# EAGLE design SMD R1.4 (EAGLE 7.5.0)
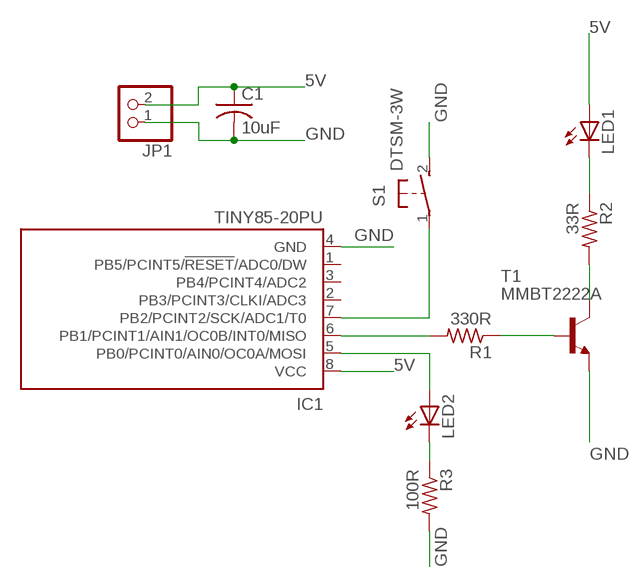
[diagram p0: schematic, sheet 1]

## Parts
C1  10uF  C-USC1206K  [C1206K]
IC1  TINY85-20PU  TINY13-20SU  [8S2]
JP1  PINHD-1X2  [1X02]
LED1  LED5MM  [LED5MM]
LED2  LEDSML1206  [SML1206]
R1  330R  R-US_R1206W  [R1206W]
R2  33R  R-US_R1206W  [R1206W]
R3  100R  R-US_R1206W  [R1206W]
S1  DTSM-3W  [DTSM-3W]
T1  MMBT2222A  MMBT2222ALT1-NPN-SOT23-BEC  [SOT23-BEC]

## Nets
5V: C1.1 IC1.8(VCC) JP1.2 LED1.A
GND: C1.2 IC1.4(GND) JP1.1 R3.2 S1.2 T1.E
N$1: IC1.5(PB0/PCINT0/AIN0/OC0A/MOSI) LED2.A
N$2: LED1.K(C) R2.1
N$3: R2.2 T1.C
N$4: R1.1 T1.B
N$5: IC1.6(PB1/PCINT1/AIN1/OC0B/INT0/MISO) R1.2
N$6: LED2.C R3.1
N$7: IC1.7(PB2/PCINT2/SCK/ADC1/T0) S1.1
Unconnected: IC1.1(PB5/PCINT5/!RESET!/ADC0/DW) IC1.2(PB3/PCINT3/CLKI/ADC3) IC1.3(PB4/PCINT4/ADC2)

## Library data of the parts
C1 = rcl:C-US: CAPACITOR, American symbol
IC1 = atmel:TINY13: 8-bit AVR Microcontroller with 1K Bytes In-System Programmable Flash Source: http://www.atmel.com/dyn/resources/prod_documents/2535S.pdf; MPN: ATTINY13-20SU; OC_FARNELL: 9171568; OC_NEWARK: 96K6522
JP1 = pinhead:PINHD-1X2: PIN HEADER
LED1 LED2 = led:LED: LED OSRAM: - CHIPLED LG R971, LG N971, LY N971, LG Q971, LY Q971, LO R971, LY R971 LH N974, LH R974 LS Q976, LO Q976, LY Q976 LO Q996 - Hyper CHIPLED LW Q18S LB Q993, LB Q99A, LB R99A - SideLED LS A670, LO A670, LY A670, LG A670, LP A670 LB A673, LV A673, LT A673, LW A673 LH A674 LY A675 LS A676, LA A676, LO A676, LY A676, LW A676 LS A679, LY A679, LG A679 - Hyper Micro SIDELED® LS Y876, LA Y876, LO Y876, LY Y876 LT Y87S - SmartLED LW L88C, LW L88S LB L89C, LB L89S, LG L890 LS L89K, LO L89K, LY L89K LS L896, LA L896, LO L896, LY L896 - TOPLED LS T670, LO T670, LY T670, LG T670, LP T670 LSG T670, LSP T670, LSY T670, LOP T670, LYG T670 LG T671, LOG T671, LSG T671 LB T673, LV T673, LT T673, LW T673 LH T674 LS T676, LA T676, LO T676, LY T676, LB T676, LH T676, LSB T676, LW T676 LB T67C, LV T67C, LT T67C, LS T67K, LO T67K, LY T67K, LW E67C LS E67B, LA E67B, LO E67B, LY E67B, LB E67C, LV E67C, LT E67C LW T67C LS T679, LY T679, LG T679 LS T770, LO T770, LY T770, LG T770, LP T770 LB T773, LV T773, LT T773, LW T773 LH T774 LS E675, LA E675, LY E675, LS T675 LS T776, LA T776, LO T776, LY T776, LB T776 LHGB T686 LT T68C, LB T68C - Hyper Mini TOPLED® LB M676 - Mini TOPLED Santana® LG M470 LS M47K, LO M47K, LY M47K Source: http://www.osram.convergy.de LUXEON: - LUMILED® LXK2-PW12-R00, LXK2-PW12-S00, LXK2-PW14-U00, LXK2-PW14-V00 LXK2-PM12-R00, LXK2-PM12-S00, LXK2-PM14-U00 LXK2-PE12-Q00, LXK2-PE12-R00, LXK2-PE12-S00, LXK2-PE14-T00, LXK2-PE14-U00 LXK2-PB12-K00, LXK2-PB12-L00, LXK2-PB12-M00, LXK2-PB14-N00, LXK2-PB14-P00, LXK2-PB14-Q00 LXK2-PR12-L00, LXK2-PR12-M00, LXK2-PR14-Q00, LXK2-PR14-R00 LXK2-PD12-Q00, LXK2-PD12-R00, LXK2-PD12-S00 LXK2-PH12-R00, LXK2-PH12-S00 LXK2-PL12-P00, LXK2-PL12-Q00, LXK2-PL12-R00 Source: www.luxeon.com KINGBRIGHT: KA-3528ASYC Source: www.kingbright.com
R1-R3 = rcl:R-US_: RESISTOR, American symbol
S1 = switch-tact:DTSM-3W
T1 = transistor:*-NPN-: NPN Transistror BF959 corrected 2008.03.06

## Board
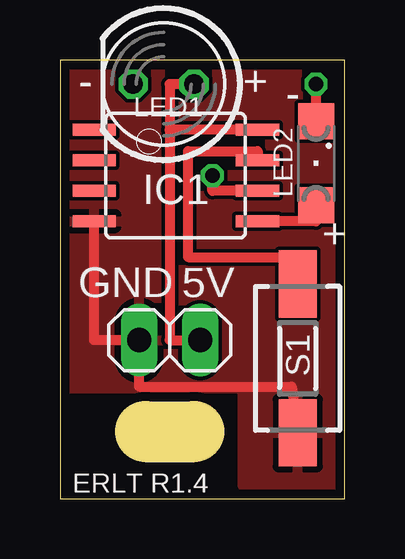
[diagram p1: board, top side]
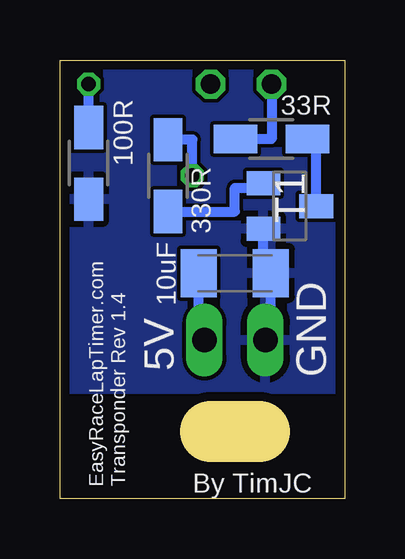
[diagram p2: board, bottom side, seen from below]

Size 11.86 x 18.28 mm. Coordinates in mm from the lower left corner, seen from the top.
Outline: 3.56,2.79 5.59,2.79
Outline: 0,0 11.86,0 11.86,18.28 0,18.28 0,0
Copper layers (1*16): Top 0.0356mm / dielectric 1.5011mm / Bottom 0.0356mm
Design rules "oshpark-2layer *": minimum track width 6mil, minimum drill 13mil, track to track 6mil, track to pad 6mil, pad to pad 6mil, via to via 6mil, smd to smd 6mil, copper to edge 15mil, drill to drill 6mil, minimum pad ring 7mil, minimum via ring 7mil, stop-mask expansion 4mil, vias tented up to drill 30mil, thermal gap 10mil

### Footprints (pad centres in the part's own frame; a part is rotated, then mirrored left to right if it is on the bottom)
C1206K = smd 1.5 x 2: 1 -1.5,0; 2 1.5,0
8S2 = smd 0.5 x 1.8: 1 -1.905,-3.404; 2 -0.645,-3.404; 3 0.625,-3.404; 4 1.895,-3.404; 5 1.905,3.404; 6 0.635,3.404; 7 -0.635,3.404; 8 -1.905,3.404
1X02 = drill 1.016 long: 1 -1.27,0; 2 1.27,0
LED5MM = drill 0.813 octagon: A -1.27,0; K 1.27,0
SML1206 = smd 1.5 x 1.5: A 1.75,0; C -1.75,0
R1206W = smd 1.8 x 1.2: 1 -1.499,0; 2 1.499,0
DTSM-3W = smd 2.8 x 1.6: 1 -3.1,0; 2 3.1,0
SOT23-BEC = smd 1 x 1.4: B -0.95,-1.1; C 0,1.1; E 0.95,-1.1

### Placement (x,y rotation side)
C1  4.57,9.4 0 bottom
IC1  4.83,13.46 270 top
JP1  4.57,6.6 0 top
LED1  4.32,17.27 180 top
LED2  10.67,13.97 270 top
R1  7.37,13.46 90 bottom
R2  3.05,14.99 0 bottom
R3  10.67,13.97 270 bottom
S1  9.91,5.84 270 top
T1  2.29,12.19 270 bottom

### Tracks (layer width: path | path; a pad name or v marks a point on that pad's centre or on a via)
5V
  Top 0.406: LED1.A 4.57,17.27 4.57,15.37 | 4.57,15.37 4.57,6.6 JP1.2 | IC1.8 4.57,15.37
  Bottom 0.406: JP1.2 6.07,6.6 C1.1
GND
  Top 0.406: S1.2 9.65,4.67 3.3,4.67 JP1.1 1.42,6.6 IC1.4
  Bottom 0.406: JP1.1 3.07,6.6 C1.2 3.39,9.4 T1.E
  pour Bottom: 0,18.54 12.19,18.54 12.19,4.57 0,4.57
  pour Top: -0.25,18.29 11.94,18.29 11.94,0.51 7.62,0.51 7.62,4.57 -0.25,4.57
N$1
  Top 0.406: LED2.A 10.67,11.56 IC1.5
N$2
  Bottom 0.406: LED1.K 3.05,14.99 R2.1
N$3
  Bottom 0.406: T1.C 1.19,14.99 R2.2
N$4
  Bottom 0.406: R1.1 4.57,11.96 4.57,12.95 3.39,12.95 T1.B
N$5  (via drill 0.6)
  Top 0.406: IC1.6 6.35,12.83 v6.35,13.46
  Bottom 0.406: v6.35,13.46 6.35,14.96 R1.2
N$6  (via drill 0.6)
  Top 0.406: LED2.C v10.67,17.27
  Bottom 0.406: R3.1 v10.67,17.27
N$7
  Top 0.406: S1.1 9.65,10.07 5.33,10.07 5.33,14.48 8.23,14.48 IC1.7

### Text on the board
Dimension: Cut out
tNames: - | + | - | + | GND | 5V | ERLT R1.4
bNames: GND | 5V | EasyRaceLapTimer.com / Transponder Rev 1.4 | By TimJC